# EAGLE design BluePillF4 (EAGLE 7.7.0)
AUTHOR: www.stm32duino.com; REV: A

## Sheet 1 of 2
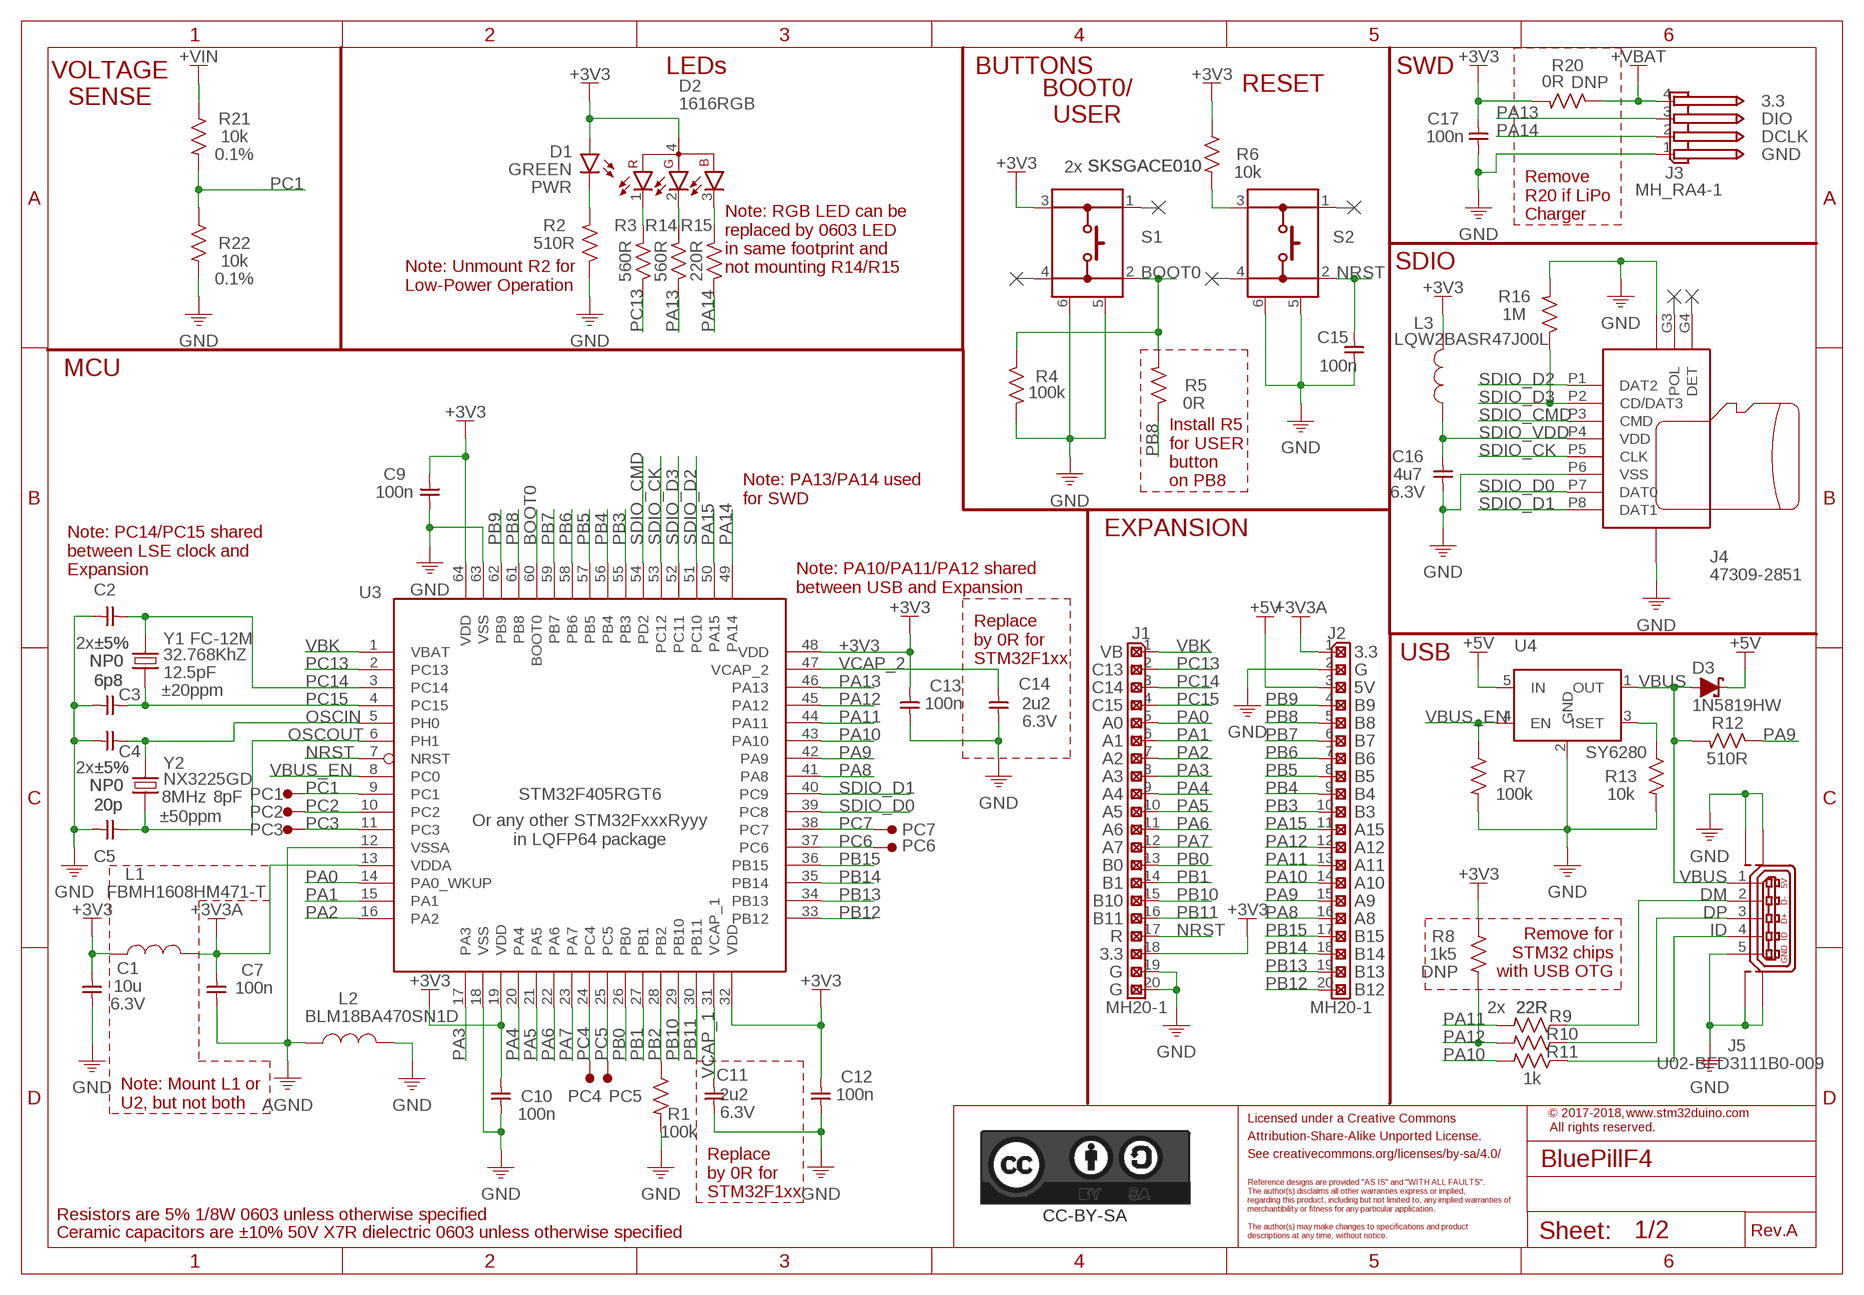
[diagram p0: schematic, sheet 1]
PORT1 (NC): BOM: EXCLUDE
PORT2 (NC): BOM: EXCLUDE
PORT3 (NC): BOM: EXCLUDE
PORT4 (NC): BOM: EXCLUDE
PORT5 (NC): BOM: EXCLUDE
PORT6 (NC): BOM: EXCLUDE

### Parts
C1  10u  CAP_0603  [C0603]
C2  6p8  CAP_0603  [C0603]
C3  6p8  CAP_0603  [C0603]
C4  20p  CAP_0603  [C0603]
C5  20p  CAP_0603  [C0603]
C7  100n  CAP_0603  [C0603]
C9  100n  CAP_0603  [C0603]
C10  100n  CAP_0603  [C0603]
C11  2u2  CAP_0603  [C0603]
C12  100n  CAP_0603  [C0603]
C13  100n  CAP_0603  [C0603]
C14  2u2  CAP_0603  [C0603]
C15  100n  CAP_0603  [C0603]
C16  4u7  CAP_0603  [C0603]
C17  100n  CAP_0603  [C0603]
D1  GREEN  LED_0603  [LED0603]
D2  1616RGB  [1616RGB]
D3  1N5819HW  [SOD-123]
J1  MH20-1  [MH20-1-0.1]
J2  MH20-1  [MH20-1-0.1]
J3  MH_RA4-1  [MH_RA4-1-0.1]
J4  47309-2851  [47309-2851]
J5  U02-BFD3111B0-009  [U02-BFD3111B0-009]
L1  FBMH1608HM471-T  FB_0603  [FB0603]
L2  BLM18BA470SN1D  FB_0603  [FB0603]
L3  LQW2BASR47J00L  FB_0805  [FB0805]
LOGO1  CC-BY-SA_LOGO  [CC-BY-SA_LOGO]
PC1  TEST_PAD  [TEST_PAD]
PC2  TEST_PAD  [TEST_PAD]
PC3  TEST_PAD  [TEST_PAD]
PC4  TEST_PAD  [TEST_PAD]
PC5  TEST_PAD  [TEST_PAD]
PC6  TEST_PAD  [TEST_PAD]
PC7  TEST_PAD  [TEST_PAD]
R1  100k  RES_0603  [R0603]
R2  510R  RES_0603  [R0603]
R3  560R  RES_0603  [R0603]
R4  100k  RES_0603  [R0603]
R5  0R  RES_0603  [R0603]
R6  10k  RES_0603  [R0603]
R7  100k  RES_0603  [R0603]
R8  1k5  RES_0603  [R0603]
R9  22R  RES_0603  [R0603]
R10  22R  RES_0603  [R0603]
R11  1k  RES_0603  [R0603]
R12  510R  RES_0603  [R0603]
R13  10k  RES_0603  [R0603]
R14  560R  RES_0603  [R0603]
R15  220R  RES_0603  [R0603]
R16  1M  RES_0603  [R0603]
R20  0R  RES_0603  [R0603]
R21  10k  RES_0603  [R0603]
R22  10k  RES_0603  [R0603]
S1  SKSGACE010  [SKSGACE010]
S2  SKSGACE010  [SKSGACE010]
U3  STM32F405RGT6  [LQFP64]
U4  SY6280  [SOT23-5]
Y1  FC-12M  [FC-12M]
Y2  NX3225GD  [CRYSTAL_32X25_2P]

### Nets
+3V3: C1.1 C9.2 C10.2 C12.1 C13.1 C17.2 D1.2(A) D2.4(A) J1.18 L1.1 L3.2 R6.1 R8.1 R20.2 S1.3(A) U3.19(VDD) U3.32(VDD) U3.48(VDD) U3.64(VDD) ; also sheet 2
+3V3A: C7.2 J2.1 L1.2 U3.13(VDDA) ; also sheet 2
+5V: D3.C J2.3 U4.5(IN) ; also sheet 2
+VBAT: J3.4 R20.1 ; also sheet 2
+VIN: R21.1 ; also sheet 2
AGND: C7.1 L2.1 U3.12(VSSA) ; also sheet 2
BOOT0: R4.1 R5.2 S1.2(B) U3.60(BOOT0)
D1: D1.1(C) R2.2
D2_B: D2.3(CB) R15.2
D2_G: D2.2(CG) R14.2
D2_R: D2.1(CR) R3.2
DM: J5.2 R9.1
DP: J5.3 R10.1
GND: C1.2 C2.2 C3.2 C4.2 C5.2 C9.1 C10.1 C11.1 C12.2 C13.2 C14.1 C15.1 C16.1 C17.1 J1.19 J1.20 J2.2 J3.1 J4.G1(GND) J4.G2(GND) J4.P6(VSS) J5.5 J5.S$1(M0) J5.S$2(M1) J5.S$3(M2) J5.S$4(M3) L2.2 R1.2 R2.1 R4.2 R7.2 R13.2 R16.2 R22.2 S1.5 S1.6 S2.5 S2.6 U3.18(VSS) U3.63(VSS) U4.2(GND) ; also sheet 2
ID: J5.4 R11.1
ISET: R13.1 U4.3(ISET)
NRST: C15.2 J1.17 S2.2(B) U3.7(NRST)
OSCIN: C4.1 U3.5(PH0) Y2.2
OSCOUT: C5.1 U3.6(PH1) Y2.1
PA0: J1.5 U3.14(PA0_WKUP)
PA1: J1.6 U3.15(PA1)
PA2: J1.7 U3.16(PA2)
PA3: J1.8 U3.17(PA3)
PA4: J1.9 U3.20(PA4)
PA5: J1.10 U3.21(PA5)
PA6: J1.11 U3.22(PA6)
PA7: J1.12 U3.23(PA7)
PA8: J2.16 U3.41(PA8)
PA9: J2.15 R12.1 U3.42(PA9)
PA10: J2.14 R11.2 U3.43(PA10)
PA11: J2.13 R9.2 U3.44(PA11)
PA12: J2.12 R8.2 R10.2 U3.45(PA12)
PA13: J3.3 R14.1 U3.46(PA13)
PA14: J3.2 R15.1 U3.49(PA14)
PA15: J2.11 U3.50(PA15)
PB0: J1.13 U3.26(PB0)
PB1: J1.14 U3.27(PB1)
PB2: R1.1 U3.28(PB2)
PB3: J2.10 U3.55(PB3)
PB4: J2.9 U3.56(PB4)
PB5: J2.8 U3.57(PB5)
PB6: J2.7 U3.58(PB6)
PB7: J2.6 U3.59(PB7)
PB8: J2.5 R5.1 U3.61(PB8)
PB9: J2.4 U3.62(PB9)
PB10: J1.15 U3.29(PB10)
PB11: J1.16 U3.30(PB11)
PB12: J2.20 U3.33(PB12)
PB13: J2.19 U3.34(PB13)
PB14: J2.18 U3.35(PB14)
PB15: J2.17 U3.36(PB15)
PC1: PC1.1(PP) R21.2 R22.1 U3.9(PC1)
PC2: PC2.1(PP) U3.10(PC2)
PC3: PC3.1(PP) U3.11(PC3)
PC4: PC4.1(PP) U3.24(PC4)
PC5: PC5.1(PP) U3.25(PC5)
PC6: PC6.1(PP) U3.37(PC6)
PC7: PC7.1(PP) U3.38(PC7)
PC13: J1.2 R3.1 U3.2(PC13)
PC14: C2.1 J1.3 U3.3(PC14) Y1.2
PC15: C3.1 J1.4 U3.4(PC15) Y1.1
R6: R6.2 S2.3(A)
SDIO_CK: J4.P5(CLK) U3.53(PC12)
SDIO_CMD: J4.P3(CMD) U3.54(PD2)
SDIO_D0: J4.P7(DAT0) U3.39(PC8)
SDIO_D1: J4.P8(DAT1) U3.40(PC9)
SDIO_D2: J4.P1(DAT2) U3.51(PC10)
SDIO_D3: J4.P2(CD/DAT3) R16.1 U3.52(PC11)
SDIO_VDD: C16.2 J4.P4(VDD) L3.1
VBK: J1.1 U3.1(VBAT)
VBUS: D3.A J5.1 R12.2 U4.1(OUT)
VBUS_EN: R7.1 U3.8(PC0) U4.4(EN)
VCAP_1: C11.2 U3.31(VCAP_1)
VCAP_2: C14.2 U3.47(VCAP_2)
Unconnected: J4.G3(POL) J4.G4(DET) S1.1(A) S1.4(B) S2.1(A) S2.4(B)

### Notes on the sheet
- LEDs | BUTTONS | SWD
- VOLTAGE
  SENSE
- RESET
- BOOT0/
  USER
- 3.3
- DIO
- DCLK
- GND
- 2x
- PWR
- Remove
  R20 if LiPo
  Charger
- SDIO
- Note: RGB LED can be
  replaced by 0603 LED
  in same footprint and
  not mounting R14/R15
- Note: Unmount R2 for
  Low-Power Operation
- MCU
- Install R5
  for USER
  button
  on PB8
- Note: PA13/PA14 used
  for SWD
- EXPANSION
- Note: PC14/PC15 shared
  between LSE clock and
  Expansion
- Note: PA10/PA11/PA12 shared
  between USB and Expansion
- 2x
- VB | 3.3 | USB
- Replace
  by 0R for
  STM32F1xx
- C13 | G
- C14 | 5V
- C15 | B9
- A0 | B8
- A1 | B7
- A2 | B6
- 2x
- A3 | B5
- A4 | B4
- A5 | B3
- Or any other STM32FxxxRyyy
  in LQFP64 package
- A6 | A15
- A7 | A12
- B0 | A11
- B1 | A10
- B10 | A9
- B11 | A8
- R | B15
- 3.3 | B14
- G | B13
- Remove for
  STM32 chips
  with USB OTG
- G | B12
- 2x
- Note: Mount L1 or
  U2, but not both
- © 2017-2018,
- Licensed under a Creative Commons
- All rights reserved.
- Attribution-Share-Alike Unported License.
- See creativecommons.org/licenses/by-sa/4.0/
- Reference designs are provided "AS IS" and "WITH ALL FAULTS".
- The author(s) disclaims all other warranties express or implied,
- Replace
  by 0R for
  STM32F1xx
- regarding this product, including but not limited to, any implied warranties of
- merchantibility or fitness for any particular application.
- Resistors are 5% 1/8W 0603 unless otherwise specified
- The author(s) may make changes to specifications and product
- Ceramic capacitors are ±10% 50V X7R dielectric 0603 unless otherwise specified | descriptions at any time, without notice. | Rev.

## Sheet 2 of 2
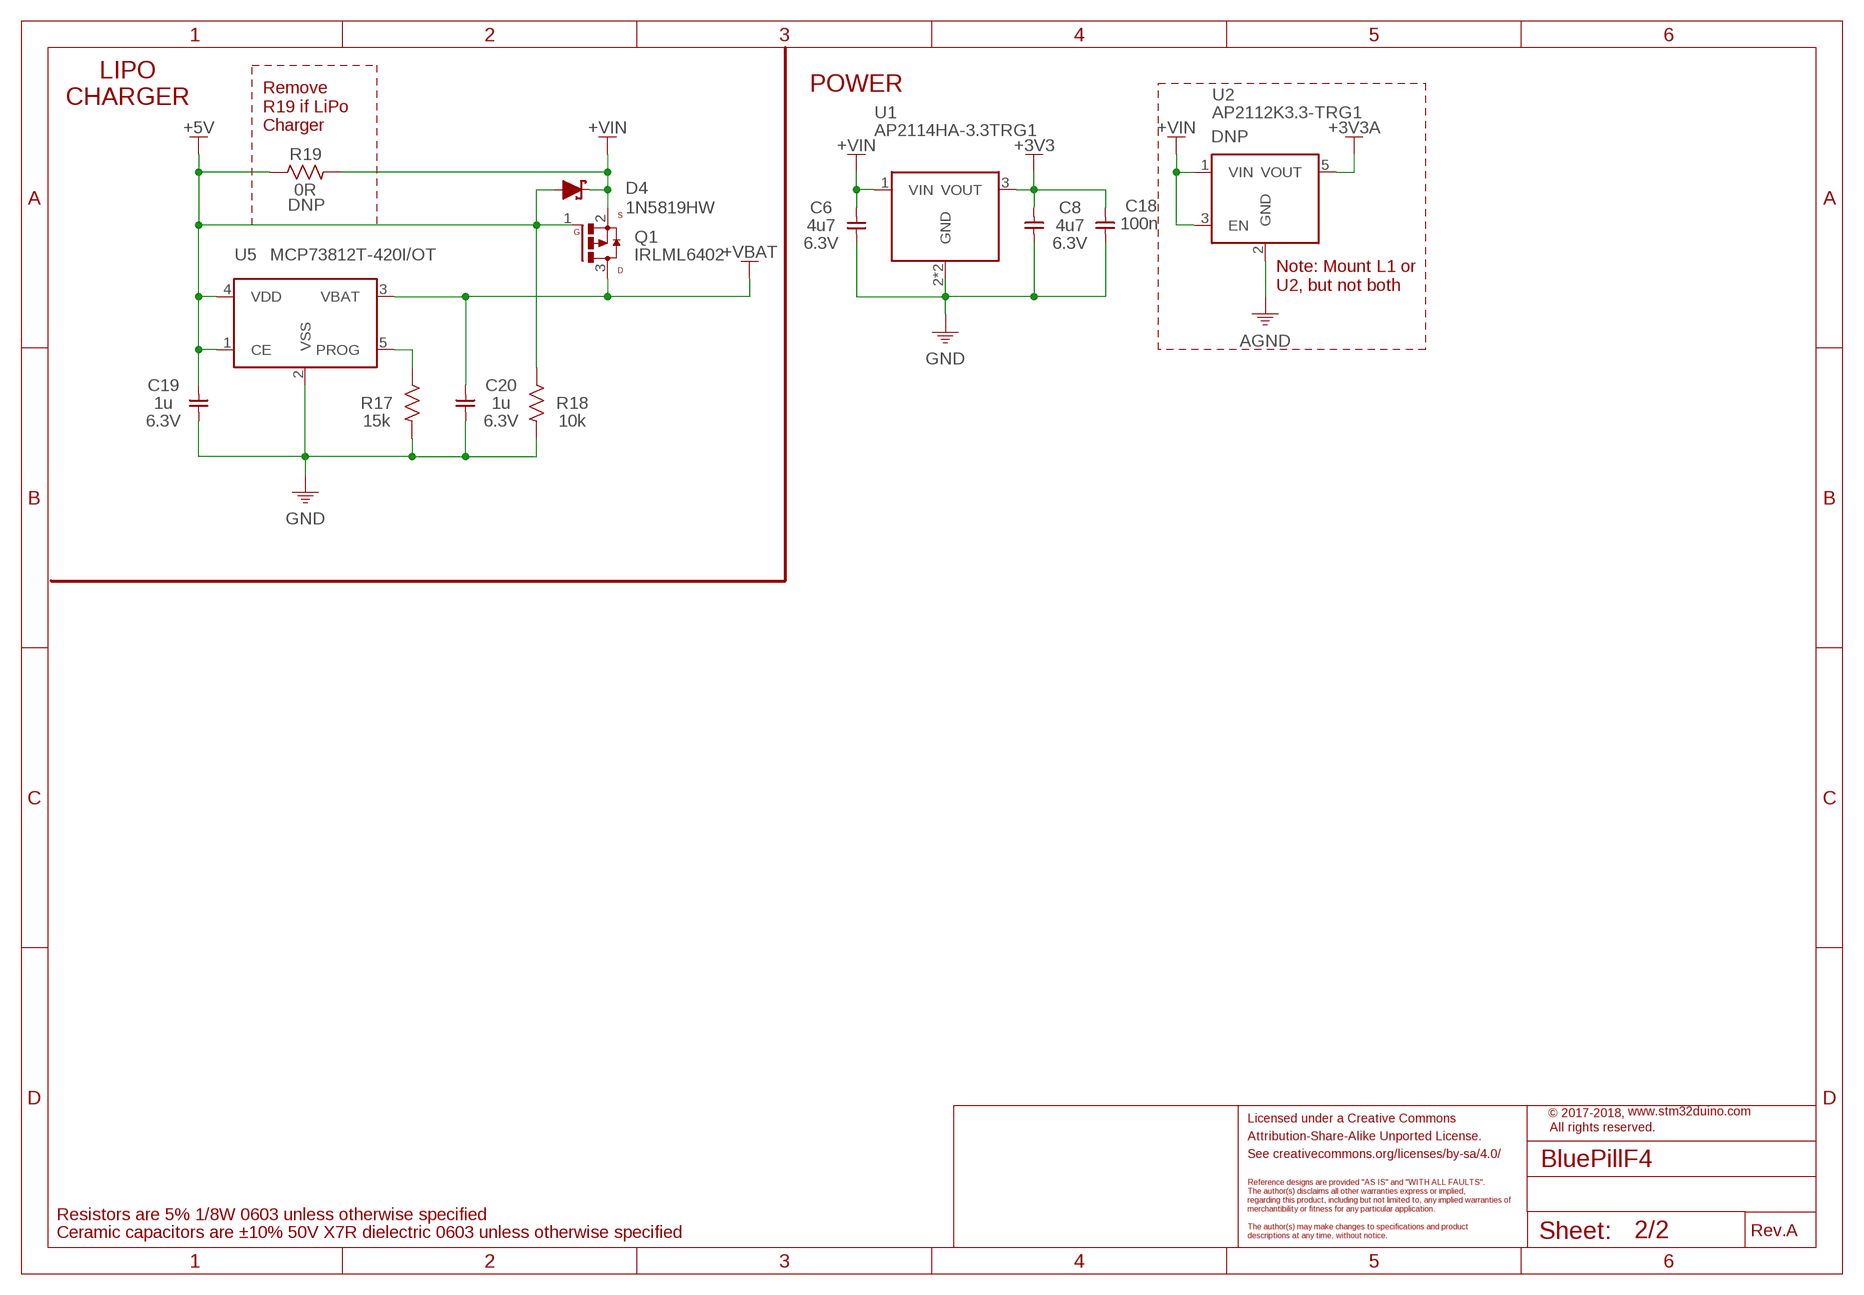
[diagram p1: schematic, sheet 2]

### Parts
C6  4u7  CAP_0603  [C0603]
C8  4u7  CAP_0603  [C0603]
C18  100n  CAP_0603  [C0603]
C19  1u  CAP_0603  [C0603]
C20  1u  CAP_0603  [C0603]
D4  1N5819HW  [SOD-123]
Q1  IRLML6402  [SOT323]
R17  15k  RES_0603  [R0603]
R18  10k  RES_0603  [R0603]
R19  0R  RES_0603  [R0603]
U1  AP2114HA-3.3TRG1  [SOT223]
U2  AP2112K3.3-TRG1  [SOT23-5]
U5  MCP73812T-420I/OT  [SOT23-5]

### Nets
+3V3: C8.1 C18.1 U1.3(VOUT) ; also sheet 1
+3V3A: U2.5(VOUT) ; also sheet 1
+5V: C19.1 D4.A Q1.1(G) R18.1 R19.1 U5.1(CE) U5.4(VDD) ; also sheet 1
+VBAT: C20.1 Q1.3(D) U5.3(VBAT) ; also sheet 1
+VIN: C6.1 D4.C Q1.2(S) R19.2 U1.1(VIN) U2.1(VIN) U2.3(EN) ; also sheet 1
AGND: U2.2(GND) ; also sheet 1
GND: C6.2 C8.2 C18.2 C19.2 C20.2 R17.2 R18.2 U1.2(GND) U1.PAD(GND) U5.2(VSS) ; also sheet 1
PROG: R17.1 U5.5(PROG)

### Notes on the sheet
- LIPO
  CHARGER
- POWER
- Remove
  R19 if LiPo
  Charger
- Note: Mount L1 or
  U2, but not both
- © 2017-2018,
- Licensed under a Creative Commons
- All rights reserved.
- Attribution-Share-Alike Unported License.
- See creativecommons.org/licenses/by-sa/4.0/
- Reference designs are provided "AS IS" and "WITH ALL FAULTS".
- The author(s) disclaims all other warranties express or implied,
- regarding this product, including but not limited to, any implied warranties of
- merchantibility or fitness for any particular application.
- Resistors are 5% 1/8W 0603 unless otherwise specified
- The author(s) may make changes to specifications and product
- Ceramic capacitors are ±10% 50V X7R dielectric 0603 unless otherwise specified | descriptions at any time, without notice. | Rev.

## Library data of the parts
C1 = BluePillF4:CAP_: Capacitor; PARTNO: C0603_10u_X7R_10%_CER_6V3; SIZE: 0603; TC: X7R; TOL: ±10%; TYPE: CER; VOLT: 6.3V
C2 C3 = BluePillF4:CAP_: Capacitor; PARTNO: C0603_6p8_NP0_5%_CER_50V; SIZE: 0603; TC: NP0; TOL: ±5%; TYPE: CER; VOLT: 50V
C4 C5 = BluePillF4:CAP_: Capacitor; PARTNO: C0603_20p_NP0_5%_CER_50V; SIZE: 0603; TC: NP0; TOL: ±5%; TYPE: CER; VOLT: 50V
C6 C8 C16 = BluePillF4:CAP_: Capacitor; PARTNO: C0603_4u7_X7R_10%_CER_6V3; SIZE: 0603; TC: X7R; TOL: ±10%; TYPE: CER; VOLT: 6.3V
C7 C9 C10 C12 C13 C15 C17 C18 = BluePillF4:CAP_: Capacitor; PARTNO: C0603_100n_X7R_10%_CER_50V; SIZE: 0603; TC: X7R; TOL: ±10%; TYPE: CER; VOLT: 50V
C11 C14 = BluePillF4:CAP_: Capacitor; PARTNO: C0603_2u2_X7R_10%_CER_6V3; SIZE: 0603; TC: X7R; TOL: ±10%; TYPE: CER; VOLT: 6.3V
C19 C20 = BluePillF4:CAP_: Capacitor; PARTNO: C0603_1u_X7R_10%_CER_6V3; SIZE: 0603; TC: X7R; TOL: ±10%; TYPE: CER; VOLT: 6.3V
D1 = BluePillF4:LED_: LED; PARTNO: LED0603-GREEN
D2 = BluePillF4:1616RGB: 16 mm x 16 mm RGB LED with Common Anode; PARTNO: LED1616-RGB
D3 D4 = BluePillF4:1N5819HW: 1.0A Surface Mount Schottky Barrier Rectifier; PARTNO: 1N5819HW; RATE: 1A; VOLT: 40V
J1 J2 = BluePillF4:MH20-1: 20x1 Pin Male Header; PARTNO: MH20-1-0.1
J3 = BluePillF4:MH_RA4-1: 4x1 Pin Male Header; PARTNO: MH_RA4-1-0.1
J4 = BluePillF4:47309-*: TFR Header with Detect Pin; HEIGHT: 2.85mm; PARTNO: 47309-2851
J5 = BluePillF4:U02-BFD3111B0-009: Mid mount PCB SMT Micro USB Type B Female Socket Solder Jack 5 Pin 4 legs; PARTNO: U02-BFD3111B0-009
L1 = BluePillF4:FB_: Ferrite Bead; PARTNO: FBMH1608HM471-T; RATE: 1A; SIZE: 0603
L2 = BluePillF4:FB_: Ferrite Bead; PARTNO: BLM18BA470SN1D; RATE: 300mA; SIZE: 0603
L3 = BluePillF4:FB_: Ferrite Bead; PARTNO: LQW2BASR47J00L; RATE: 250mA; SIZE: 0805
LOGO1 = BluePillF4:CC-BY-SA_LOGO: Attribution-Share-Alike Unported License See creativecommons.org/licenses/by-sa/3.0/ for details.; BOM: EXCLUDE
PC1-PC7 = BluePillF4:TEST_PAD: Test Pad; BOM: EXCLUDE
Q1 = BluePillF4:IRLML6402: HEXFET Power MOSFET; PARTNO: IRLM6402; RATE: 1.3A; VOLT: 20V
R1 R4 R7 = BluePillF4:RES_: Resistor; PARTNO: R0603_100k_5%_125mW; RATE: 125mW; SIZE: 0603; TOL: 5%
R2 R3 R5 R12 R14 R15 = BluePillF4:RES_: Resistor; PARTNO: R0603_510R_5%_125mW; RATE: 125mW; SIZE: 0603; TOL: 5%
R6 R13 = BluePillF4:RES_: Resistor; PARTNO: R0603_10k_5%_125mW; RATE: 125mW; SIZE: 0603; TOL: 5%
R8 = BluePillF4:RES_: Resistor; DNP: T; PARTNO: R0603_1k5_5%_125mW; RATE: 125mW; SIZE: 0603; TOL: 5%
R9 R10 = BluePillF4:RES_: Resistor; PARTNO: R0603_22R_5%_125mW; RATE: 125mW; SIZE: 0603; TOL: 5%
R11 = BluePillF4:RES_: Resistor; PARTNO: R0603_1k_5%_125mW; RATE: 125mW; SIZE: 0603; TOL: 5%
R16 = BluePillF4:RES_: Resistor; PARTNO: R0603_1M_5%_125mW; RATE: 125mW; SIZE: 0603; TOL: 5%
R17 R18 = BluePillF4:RES_: Resistor; PARTNO: R0603_15k_5%_125mW; RATE: 125mW; SIZE: 0603; TOL: 5%
R19 = BluePillF4:RES_: Resistor; DNP: T; PARTNO: R06030R_5%_125mW; RATE: 125mW; SIZE: 0603; TOL: 5%
R20 = BluePillF4:RES_: Resistor; DNP: T; PARTNO: R0603_510R_5%_125mW; RATE: 125mW; SIZE: 0603; TOL: 5%
R21 R22 = BluePillF4:RES_: Resistor; DNP: F; PARTNO: R0603_10k_0.1%_125mW; RATE: 125mW; SIZE: 0603; TOL: 0.1%
S1 S2 = BluePillF4:SKSGACE010: Surface Mount Type TACT Switch; HEIGHT: 1.4mm; PARTNO: SKSGACE010
U1 = BluePillF4:AP2114?-*TRG1: 1A Low-Noise CMOS LDO Regulator; HEIGHT: 1.7mm; PARTNO: AP2114HA3.3-TRG1; RATE: 1A; VOLT: 3.3V
U2 = BluePillF4:AP2112?*-TRG1: 600mA CMOS LDO Regulator with Enable; DNP: T; HEIGHT: 1.3mm; PARTNO: AP2112K3.3-TRG1; RATE: 1A; VOLT: 3.3V
U3 = BluePillF4:STM32F405?: ARM Cortex-M4 32b MCU+FPU, 210DMIPS, up to 1MB Flash/192+4KB RAM, USB OTG HS/FS, Ethernet, 17 TIMs, 3 ADCs, 15 comm. interfaces & camera; HEIGHT: 1.6mm; PARTNO: STM32F405RGT6
U4 = BluePillF4:SY6280: Low-Loss Power Distribution Switch; HEIGHT: 1.3mm; PARTNO: SY6280AAC
U5 = BluePillF4:MCP7381*T-420I/OT: Simple, Miniature Single-Cell, Fully Integrated Li-Ion / Li-Polymer Charge Management Controllers; PARTNO: MCP73812T-420I/OT
Y1 = BluePillF4:FC-12M: Seiko Epson kHz Range 2 pin Crystal; CAP: 12.5pF; FREQ: 32.768KhZ; PARTNO: FC-12M 32.7680KA-A3; TOL: ±20ppm
Y2 = BluePillF4:NX3225GD: 3.2 mm x 2.5 mm Crystal, 2 Pads; CAP: 8pF; FREQ: 8MHz; PARTNO: NX3225GD-8MHZ-STD-CRA-3; TOL: ±50ppm

## Board
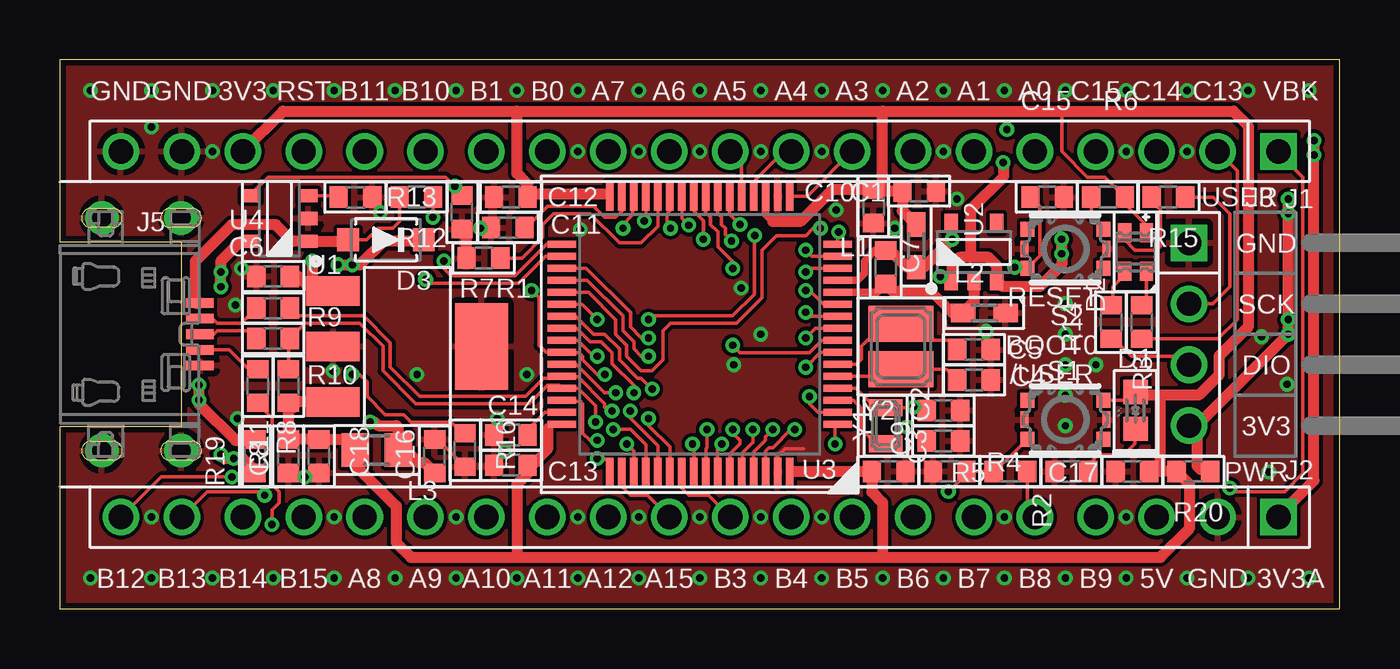
[diagram p2: board, top side]
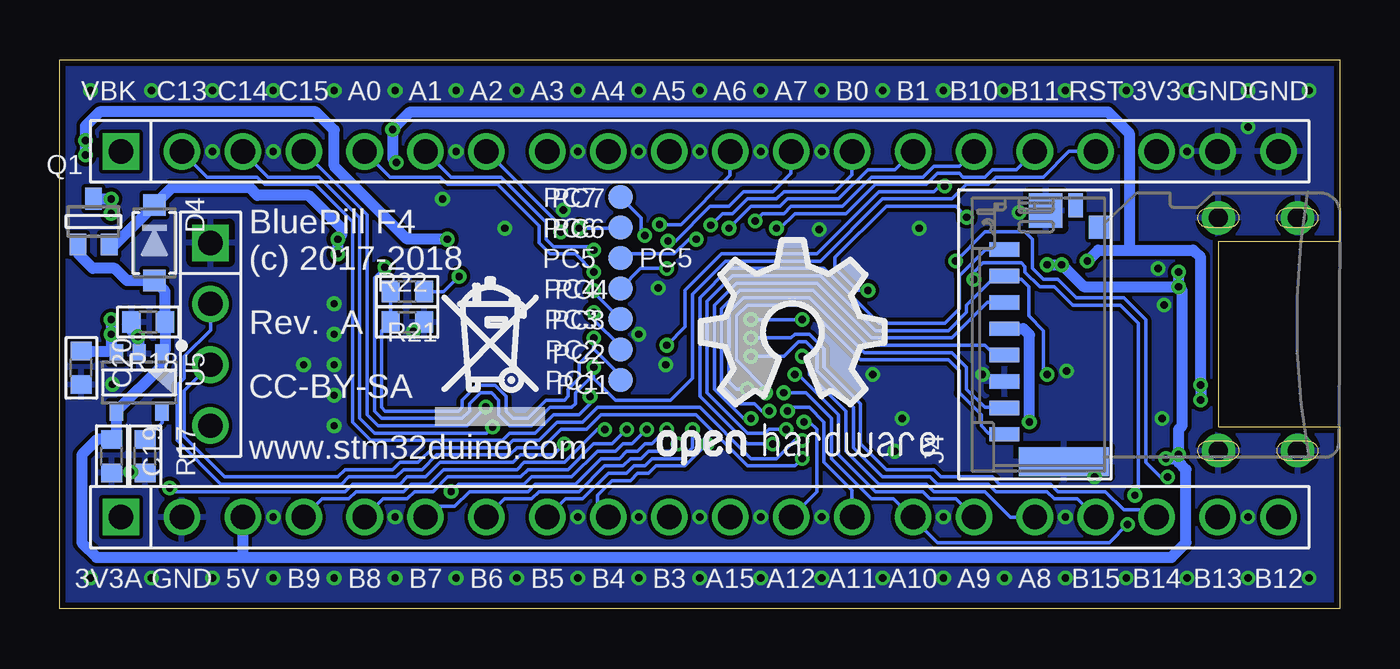
[diagram p3: board, bottom side, seen from below]

Size 53.34 x 22.86 mm. Coordinates in mm from the lower left corner, seen from the top.
Outline: 0,0 53.34,0 53.34,22.86 0,22.86 0,15.28 5.05,15.28 5.05,7.58 0,7.58 0,0
Copper layers (1*16): Top 0.035mm / dielectric 1.5mm / Bottom 0.035mm
Design rules "SeeedStudio_2layer_DRU_no_angle_20140221 *": minimum track width 6mil, minimum drill 12mil, track to track 6mil, track to pad 6mil, pad to pad 6mil, via to via 6mil, smd to smd 0mil, copper to edge 10mil, drill to drill 10mil, minimum pad ring 10mil, minimum via ring 6mil, stop-mask expansion 2mil, vias tented up to drill 100mil, thermal gap 10mil

### Footprints (pad centres in the part's own frame; a part is rotated, then mirrored left to right if it is on the bottom)
C0603 = smd 0.762 x 0.889: 1 -0.699,0; 2 0.699,0
LED0603 = smd 1.016 x 1.016: 1 -0.762,0; 2 0.762,0
1616RGB = smd 0.8 x 0.55: 1 -0.8,-0.45; 2 -0.8,0.45; 3 0.8,0.45; 4 0.8,-0.45
SOD-123 = smd 0.9 x 0.95: A 1.575,0; C -1.575,0
MH20-1-0.1 = drill 1.016 square: 1 0,0 | drill 1.016: 2 2.54,0; 3 5.08,0; 4 7.62,0; 5 10.16,0; 6 12.7,0; 7 15.24,0; 8 17.78,0; 9 20.32,0; 10 22.86,0; 11 25.4,0; 12 27.94,0; 13 30.48,0; 14 33.02,0; 15 35.56,0; 16 38.1,0; 17 40.64,0; 18 43.18,0; 19 45.72,0; 20 48.26,0
MH_RA4-1-0.1 = drill 1.016 square: 1 -3.81,-3.81 | drill 1.016: 2 -1.27,-3.81; 3 1.27,-3.81; 4 3.81,-3.81
47309-2851 = smd 1.2 x 3.75: G1 -5,-2.48 | smd 1.45 x 1.4: G2 5.475,-1.725 | smd 1 x 0.6: G3 5.7,-2.975 | smd 0.95 x 0.85: G4 4.775,-3.95 | smd 0.6 x 1.25: P1 3.85,0; P2 2.75,0; P3 1.65,0; P4 0.55,0; P5 -0.55,0; P6 -1.65,0; P7 -2.75,0; P8 -3.85,0
U02-BFD3111B0-009 = smd 0.4 x 1.15: 1 -1.3,3.93; 2 -0.65,3.93; 3 0,3.93; 4 0.65,3.93; 5 1.3,3.93 | drill 0.8 pad 1.4: S$1 -4.85,-0.155; S$2 4.85,-0.155; S$3 -4.85,3.145; S$4 4.85,3.145
FB0603 = smd 1.016 x 0.762: 1 -0.889,0; 2 0.889,0
FB0805 = smd 1.15 x 1.4: 1 -0.9,0; 2 0.9,0
TEST_PAD = smd 1 x 1: 1 0,0
SOT323 = smd 0.7 x 0.9: 1 -0.65,-0.95; 2 0.65,-0.95; 3 0,0.95
R0603 = smd 0.762 x 0.889: 1 -0.699,0; 2 0.699,0
SKSGACE010 = smd 0.575 x 0.625: 1 -1.587,0.812; 2 -1.587,-0.812; 3 1.587,0.812; 4 1.587,-0.812 | smd 0.325 x 0.699: 5 -1.712,0; 6 1.712,0
SOT223 = smd 1.219 x 2.235: 1 -2.311,-3.099; 2 0,-3.099; 3 2.311,-3.099 | smd 3.6 x 2.2: PAD 0,3.099
SOT23-5 = smd 0.55 x 0.8: 1 -0.95,-1.2; 2 0,-1.2; 3 0.95,-1.2; 4 0.95,1.2; 5 -0.95,1.2
LQFP64 = smd 1.2 x 0.3: 1 -5.75,3.75; 2 -5.75,3.25; 3 -5.75,2.75; 4 -5.75,2.25; 5 -5.75,1.75; 6 -5.75,1.25; 7 -5.75,0.75; 8 -5.75,0.25; 9 -5.75,-0.25; 10 -5.75,-0.75; 11 -5.75,-1.25; 12 -5.75,-1.75; 13 -5.75,-2.25; 14 -5.75,-2.75; 15 -5.75,-3.25; 16 -5.75,-3.75; 33 5.75,-3.75; 34 5.75,-3.25; 35 5.75,-2.75; 36 5.75,-2.25; 37 5.75,-1.75; 38 5.75,-1.25; 39 5.75,-0.75; 40 5.75,-0.25; 41 5.75,0.25; 42 5.75,0.75; 43 5.75,1.25; 44 5.75,1.75; 45 5.75,2.25; 46 5.75,2.75; 47 5.75,3.25; 48 5.75,3.75 | smd 0.3 x 1.2: 17 -3.75,-5.75; 18 -3.25,-5.75; 19 -2.75,-5.75; 20 -2.25,-5.75; 21 -1.75,-5.75; 22 -1.25,-5.75; 23 -0.75,-5.75; 24 -0.25,-5.75; 25 0.25,-5.75; 26 0.75,-5.75; 27 1.25,-5.75; 28 1.75,-5.75; 29 2.25,-5.75; 30 2.75,-5.75; 31 3.25,-5.75; 32 3.75,-5.75; 49 3.75,5.75; 50 3.25,5.75; 51 2.75,5.75; 52 2.25,5.75; 53 1.75,5.75; 54 1.25,5.75; 55 0.75,5.75; 56 0.25,5.75; 57 -0.25,5.75; 58 -0.75,5.75; 59 -1.25,5.75; 60 -1.75,5.75; 61 -2.25,5.75; 62 -2.75,5.75; 63 -3.25,5.75; 64 -3.75,5.75
FC-12M = smd 0.7 x 1.4: 1 -0.75,0; 2 0.75,0
CRYSTAL_32X25_2P = smd 1.5 x 2.7: 1 -0.95,0; 2 0.95,0

### Placement (x,y rotation side)
C1  35.81,17.4 0 top
C2  36.83,6.99 0 top
C3  36.83,8.26 0 top
C4  38.1,9.53 0 top
C5  38.1,10.79 0 top
C6  8.89,13.84 180 top
C7  34.42,14.22 90 top
C8  9.53,6.35 270 top
C9  34.54,5.71 180 top
C10  33.91,16.76 90 top
C11  18.67,15.88 0 top
C12  18.8,17.14 180 top
C13  18.8,5.97 180 top
C14  18.8,7.24 0 top
C15  41.15,17.14 180 top
C16  15.62,6.35 270 top
C17  44.7,5.71 0 top
C18  10.79,6.35 270 top
C19  51.18,6.35 270 bottom
C20  52.45,10.03 270 bottom
D1  44.83,8.26 90 top
D2  44.83,14.86 90 top
D3  13.59,15.37 180 top
D4  49.4,15.24 270 bottom
DRILEGEND  [DRILEGEND]  91.69,25.65 0 top  (outside the outline)
J1  50.8,19.05 180 top
J2  50.8,3.81 180 top
J3  50.88,11.43 270 top
J4  13.97,11.11 90 bottom
J5  1.91,11.43 270 top
L1  35.69,15.11 270 top
L2  38.53,12.32 0 top
L3  13.21,6.6 180 top
LOGO1  5.08,-53.34 0 top  (outside the outline)
PC1  29.97,9.53 180 bottom
PC2  29.97,10.79 180 bottom
PC3  29.97,12.06 180 bottom
PC4  29.97,13.34 180 bottom
PC5  29.97,14.61 0 bottom
PC6  29.97,15.88 0 bottom
PC7  29.97,17.14 0 bottom
Q1  51.94,16.13 0 bottom
R1  17.65,14.61 180 top
R2  42.16,5.71 0 top
R3  45.09,11.94 90 top
R4  37.08,5.71 180 top
R5  39.62,5.71 180 top
R6  43.69,17.14 180 top
R7  16.76,16.51 270 top
R8  9.53,9.27 90 top
R9  8.89,12.52 0 top
R10  8.89,11.25 0 top
R11  8.26,9.27 270 top
R12  14.86,17.14 180 top
R13  12.32,17.14 0 top
R14  43.81,11.94 90 top
R15  46.2,17.14 180 top
R16  16.89,6.6 270 top
R17  49.78,6.35 270 bottom
R18  49.66,11.94 180 bottom
R19  8.13,6.35 90 top
R20  47.24,5.71 180 top
R21  38.86,13.21 180 bottom
R22  38.86,11.94 0 bottom
S1  41.91,7.87 0 top
S2  41.91,14.99 0 top
U1  14.48,10.92 270 top
U2  38.1,14.86 0 top
U3  26.67,11.43 180 top
U4  9.14,16.26 90 top
U5  50.04,9.42 180 bottom
U$2  [A5L-LOC]  -45.72,-63.5 0 top  (outside the outline)
U$4  [OPEN_HARDWARE_LOGO]  22.81,11.43 0 bottom
U$6  [RECYCLE_BIN_LOGO]  37.69,7.62 0 bottom
Y1  34.42,7.62 270 top
Y2  35.05,10.92 270 top

### Tracks (layer width: path | path; a pad name or v marks a point on that pad's centre or on a via)
+3V3
  Top 0.152: S1.3 44.5,8.69 D1.2 | 41.76,20.73 41.76,19.05 42.82,17.98 43.55,17.98 R6.1 44.39,16.88 45.28,15.98 D2.4
  Top 0.305: 20.34,7.52 20.51,7.68 U3.48 | U3.19 29.42,16.43 29.72,16.13 | U3.32 22.86,17.18 22.77,17.27 | 30.63,5.71 30.42,5.71 U3.64
  Top 0.406: 20.34,7.52 20.34,6.63 19.81,6.1
  Top 0.457: 19.05,2.13 19.05,5.18 19.49,5.63 C13.1 19.68,5.97 19.81,6.1 | 19.05,2.13 34.29,2.13 | 34.29,2.13 45.87,2.13 47.09,3.35 47.09,5.17 R20.2 45.85,5.71 | J1.18 9.3,20.73 19.05,20.73 | 19.05,20.73 34.29,20.73 | 34.29,20.73 41.76,20.73 48.92,20.73 49.53,20.12 49.53,11.73 48.31,10.52 48.31,9.73 47.47,8.89 45.85,8.89 | 19.05,20.73 19.05,18.14 19.49,17.69 C12.1 19.62,17.27 22.77,17.27 | 34.29,2.13 34.29,4.42 33.85,4.86 C9.2 30.63,5.71 | 29.72,16.13 30.86,16.13 32.19,17.46 C10.2 | 11.38,8.59 U1.3 9.83,8.61 9.75,8.53 | 19.05,2.13 14.63,2.13 14.02,2.74 14.02,4.27 12.31,5.98 L3.2 11.86,7.05 C18.1 C8.1 R8.1 9.72,8.57 9.75,8.53 | 9.75,8.61 9.75,8.53 | 9.75,8.53 9.75,8.38 | 34.29,17.4 34.29,20.73 | 45.85,5.71 C17.2 | 45.85,8.89 45.85,5.71 | 45.85,8.89 44.96,8.89 D1.2 | 34.29,17.4 C1.1 35.12,16.57 L1.1 | C10.2 33.97,17.4 34.29,17.4 | 33.83,17.48 33.83,17.39 | 33.83,17.37 33.83,17.39 | 33.83,17.39 C10.2
+3V3A  (via drill 0.3 pad 0.61)
  Top 0.305: U3.13 33.24,13.68 33.53,13.97 33.53,14.48 33.97,14.92 C7.2
  Top 0.457: U2.5 37.19,16.02 v37.19,15.39 36.02,14.22 L1.2 35.31,14.22 34.61,14.92 C7.2 | v52.27,19.51 v52.27,18.9 52.27,5.33 50.8,3.86 J2.1
  Bottom 0.457: v52.27,18.9 v52.27,19.51 52.27,20.12 51.69,20.7 42.67,20.7 41.91,19.94 41.91,18.44 38.86,15.39 v37.19,15.39
+5V  (via drill 0.3 pad 0.61)
  Top 0.457: D3.C 15.16,15.32 15.09,15.32 | R19.1 8.13,5.74 7.62,6.25 v7.24,6.25 6.86,6.25 6.71,6.4 | v6.71,13.41 v6.71,14.02 6.71,14.48 7.53,15.31 U4.5 | 15.01,15.32 15.01,15.24 | 15.01,15.24 15.01,15.16 | v11.58,14.33 v12.19,14.33 12.5,14.33 13.49,15.32 15.09,15.32 | 15.09,15.32 15.01,15.24
  Bottom 0.457: 45.72,2.13 7.01,2.13 6.4,2.74 6.4,5.79 6.71,6.1 | 6.71,6.1 v6.71,6.43 6.71,7.47 6.55,7.62 6.55,13.26 v6.71,13.41 | 45.72,2.13 51.82,2.13 52.43,2.74 52.43,6.4 51.78,7.05 C19.1 50.99,7.24 U5.4 49.09,10.12 U5.1 48.96,10.75 R18.1 48.96,13.22 D4.A 50.55,13.66 51.05,14.17 51.97,14.17 52.58,14.78 52.58,15.16 Q1.1 | J2.3 45.72,2.13 | v6.71,13.41 v6.71,14.02 | v7.24,6.25 6.86,6.25 6.71,6.1 | v12.19,14.33 v11.58,14.33 10.67,13.41 v6.71,13.41
+VBAT  (via drill 0.3 pad 0.61)
  Top 0.457: v51.21,17.07 v51.21,16.46 v51.21,12.04 v51.21,11.43 47.4,7.62 47.09,7.62 | J3.4 47.09,7.62 | 47.09,7.62 47.4,7.32 47.4,5.94 47.55,5.79 47.87,5.79 R20.1
  Bottom 0.457: v51.21,16.46 v51.21,17.07 v51.22,17.08 Q1.3 | v51.21,12.04 v51.21,11.43 51.21,10.84 | 51.21,10.84 U5.3 | C20.1 51.32,10.73 51.21,10.84
+VIN  (via drill 0.3 pad 0.61)
  Top 0.152: 37.09,13.72 U2.1 36.97,13.84 v36.7,13.84
  Top 0.457: C6.1 9.93,13.84 10.36,13.41 10.52,13.41 | 10.52,13.41 11.2,13.41 U1.1 | v5.79,9.32 v5.79,8.69 5.79,8.53 7.32,7.01 8.09,7.01 R19.2 | v41.76,15.39 v41.76,14.78 41.76,14.33 40.84,13.41 39.3,13.41 U2.3 39.05,14.29 38.71,14.63 37.95,14.63 | 37.95,14.63 37.49,14.63 37.19,14.33 37.19,13.7 U2.1 | v39.32,18.59 39.32,17.98 37.95,16.61 37.95,14.63 | v10.52,14.48 10.52,13.41
  Bottom 0.152: R21.1 37.34,13.21 v36.7,13.84
  Bottom 0.457: v5.79,8.69 v5.79,9.32 5.79,14.63 6.1,14.94 8.84,14.94 | 41.76,14.94 v41.76,15.39 41.6,15.54 41.6,15.85 42.98,17.22 45.11,17.22 45.41,17.53 48.69,17.53 D4.C 51.04,15.18 Q1.2 | v39.32,18.59 39.47,18.75 v39.47,19.96 38.73,20.7 9.65,20.7 8.76,19.81 8.76,15.01 8.84,14.94 | v10.52,14.48 10.06,14.94 8.84,14.94
AGND
  Top 0.305: U3.12 34.07,13.18 C7.1
  Top 0.406: 36.32,13.21 37.21,12.32
  Top 0.457: 37.62,12.34 L2.1 | U2.2 38.1,12.78 L2.1 | L2.1 37.21,12.32 | 36.32,13.21 34.73,13.21 C7.1
BOOT0  (via drill 0.3)
  Top 0.152: U3.60 28.45,5.71 28.45,6.5 28.88,6.93 v28.88,7.47 | v37.03,4.88 37.78,5.63 R4.1 R5.2 38.98,5.71 S1.2
  Bottom 0.152: v37.03,4.88 36.73,5.18 33.98,5.18 33.68,5.49 32,5.49 30.94,6.55 30.18,6.55 29.87,6.86 29.49,6.86 v28.88,7.47
D1
  Top 0.152: D1.1 44.81,7.47 44.81,6.86 44.35,6.4 43.28,6.4 42.86,5.98 R2.2
D2_B
  Top 0.152: D2.3 44.38,15.36 44.81,14.94 45.72,14.94 45.87,15.09 45.87,16.61 45.5,16.98 R15.2
D2_G
  Top 0.152: D2.2 44.38,13.9 43.89,13.41 43.89,12.71 R14.2
D2_R
  Top 0.152: D2.1 45.28,12.83 R3.2
DM
  Top 0.152: J5.2 6.36,12.08 6.55,11.89 7.56,11.89 R9.1
DP
  Top 0.152: J5.3 6.4,11.43 6.55,11.58 7.86,11.58 R10.1
GND  (via drill 0.3)
  Top 0.152: U3.63 29.92,6.35 30.23,6.66 30.99,6.66 | v18.54,6.55 18.54,6.41 C13.2 | C16.1 15.75,7.05 R16.2 | v10.21,5.49 10.63,5.49 C18.2
  Top 0.457: R1.2 16.95,15.62 R7.2
  Bottom 0.457: U5.2 50.04,11.33 v50.09,11.33 50.35,11.6 R18.2
  other vias: 43.18,10.16 41.91,11.43 1.27,1.27 3.81,1.27 6.35,1.27 8.89,1.27 11.43,1.27 13.97,1.27 16.51,1.27 19.05,1.27 21.59,1.27 24.13,1.27 26.67,1.27 29.21,1.27 31.75,1.27 34.29,1.27 36.83,1.27 39.37,1.27 41.91,1.27 44.45,1.27 46.99,1.27 52.07,21.59 49.53,21.59 46.99,21.59 44.45,21.59 41.91,21.59 39.37,21.59 36.83,21.59 34.29,21.59 31.75,21.59 29.21,21.59 26.67,21.59 24.13,21.59 21.59,21.59 19.05,21.59 16.51,21.59 13.97,21.59 11.43,21.59 8.89,21.59 6.35,21.59 3.81,21.59 1.27,21.59 28.09,10.16 41.91,12.7 41.91,10.16 41.91,8.89 41.91,7.62 3.81,20.07 44.45,19.05 3.81,3.81 11.43,3.81 21.59,3.81 24.13,3.81 26.67,3.81 44.45,3.81 38.61,11.56 29.21,19.05 26.67,19.05 24.13,19.05 6.35,19.05 31.75,19.05 21.59,19.05 29.21,3.81 31.75,3.81 39.37,3.81 46.99,19.05 36.83,19.05 13.36,16.51 49.53,1.27 52.07,1.27 32.36,16.61 34.8,15.85 37.39,17.07 50.39,5.69 51.16,9.35 21.69,15.8 28.4,13.36 7.39,7.92 7.57,14.17 11.38,9.91 14.88,9.75 7.32,12.65 19.46,9.75 18.24,7.92 17.53,15.85 16.51,3.81 29.21,11.43
  pour Top (rank 3): 0,22.86 53.34,22.86 53.34,0 0,0
  pour Bottom: 0,22.86 53.34,22.86 53.34,0 0,0
ID
  Top 0.152: J5.4 7.05,10.78 7.77,10.06 8.17,10.06 R11.1
ISET
  Top 0.152: U4.3 11.56,17.21 R13.1
NRST  (via drill 0.3, 0.3 pad 0.61)
  Top 0.152: 32.41,10.67 U3.7 31.71,10.68 v31.09,10.06 | S2.2 | 40.17,14.33 40.27,14.22 | 40.27,14.22 v39.8,14.22 39.78,14.25 | 40.27,14.22 S2.2 | S2.2 40.84,14.69 40.84,16.76 40.46,17.14 C15.2
  Bottom 0.152: J1.17 11.28,19.05 12.34,17.98 14.33,17.98 14.63,17.68 15.54,17.68 16.15,17.07 19.05,17.07 21.64,14.48 25.6,14.48 26.98,13.11 26.98,9.6 27.89,8.69 30.18,8.69 31.09,9.6 | v39.8,14.22 40.23,13.79 40.23,8.23 39.93,7.92 36.58,7.92 36.27,8.23 36.27,8.53 35.81,8.99 35.36,8.99 35.05,8.69 35.05,8.08 34.59,7.62 33.68,7.62 32.92,8.38 32,8.38 31.85,8.53 31.85,8.99 31.24,9.6 31.09,9.6 | 31.09,9.6 v31.09,10.06
OSCIN
  Top 0.152: U3.5 34.76,9.68 Y2.2 36.95,9.97 C4.1
OSCOUT
  Top 0.152: U3.6 33.19,10.18 33.4,10.39 33.4,10.92 34.35,11.87 Y2.1 35.07,11.89 35.74,11.89 36.45,11.18 37.02,11.18 C5.1
PA0  (via drill 0.3)
  Top 0.152: U3.14 31.25,14.18 v31.09,14.02
  Bottom 0.152: J1.5 39.57,17.98 37.49,17.98 37.19,17.68 35.1,17.68 33.38,15.95 33.38,15.25 32.91,14.78 31.85,14.78 v31.09,14.02
PA1  (via drill 0.3)
  Top 0.152: U3.15 31.34,14.68 v31.09,14.94
  Bottom 0.152: J1.6 37.03,17.98 34.95,17.98 33.07,16.1 33.07,15.39 32.77,15.09 31.24,15.09 v31.09,14.94
PA2  (via drill 0.3)
  Top 0.152: U3.16 32.42,15.66 v32.46,15.7
  Bottom 0.152: v32.46,15.7 32.64,15.88 32.64,16.13 J1.7
PA3
  Top 0.152: J1.8 31.15,17.18 U3.17
PA4
  Top 0.152: U3.20 28.92,17.8 30.18,19.05 J1.9
PA5
  Top 0.152: U3.21 28.42,18.57 J1.10
PA6  (via drill 0.3)
  Top 0.152: U3.22 27.92,16.43 v28.35,16
  Bottom 0.152: v28.35,16 27.46,16 25.4,18.06 J1.11
PA7  (via drill 0.3)
  Top 0.152: v27.99,15.32 27.74,15.57 27.74,15.85 27.58,16 27.58,16.31 27.42,16.47 U3.23
  Bottom 0.152: v27.99,15.32 27.69,15.32 26.24,16.76 25.45,16.76 24.84,17.37 23.62,17.37 22.86,18.14 J1.12
PA8  (via drill 0.3)
  Top 0.152: U3.41 21.59,11.18 22.25,10.52 v22.4,10.52
  Bottom 0.152: J2.16 13.72,3.81 14.78,4.88 16.92,4.88 17.22,5.18 19.2,5.18 20.57,6.55 20.57,8.23 22.1,9.75 22.1,10.21 v22.4,10.52
PA9  (via drill 0.3, 0.3 pad 0.61)
  Top 0.152: v15.54,16.31 15.54,17.13 R12.1 | v19.66,13.26 19.96,12.95 19.96,10.97 20.26,10.68 U3.42 20.93,10.67 21.64,10.67 21.79,10.52 21.79,10.36 22.4,9.75 v22.71,9.75
  Bottom 0.152: J2.15 16,4.57 17.07,4.57 17.37,4.88 19.36,4.88 20.88,6.4 20.88,8.08 22.55,9.75 v22.71,9.75 | v15.54,16.31 16,16.76 18.9,16.76 21.03,14.63 21.03,14.17 20.12,13.26 v19.66,13.26
PA10  (via drill 0.3, 0.3 pad 0.61)
  Top 0.152: U3.43 21.52,10.18 22.71,8.99 v23.16,8.99 | R11.2 8.26,8.51 8.84,7.92 8.84,5.18 9.14,4.88 9.14,4.42 8.84,4.12 v8.84,3.5
  Bottom 0.152: v8.84,3.5 9.6,2.74 16.76,2.74 17.78,3.76 J2.14 17.83,3.81 18.59,4.57 19.51,4.57 21.18,6.25 21.18,7.92 22.25,8.99 v23.16,8.99
PA11  (via drill 0.3)
  Top 0.152: R9.2 9.92,12.19 12.65,12.19 13.77,11.07 13.77,10.06 14.99,8.84 19.41,8.84 20.17,9.6 20.84,9.6 U3.44 20.95,9.65 21.59,9.65 22.71,8.53 22.71,8.38 22.86,8.38 v23.01,8.23
  Bottom 0.152: J2.13 20.32,4.93 21.49,6.1 21.49,7.77 22.1,8.38 22.86,8.38 v23.01,8.23
PA12  (via drill 0.3)
  Top 0.152: R8.2 9.53,11.19 R10.2 9.59,11.27 10.21,11.89 12.5,11.89 13.46,10.92 13.46,9.91 14.83,8.53 19.56,8.53 20.32,9.3 20.8,9.3 U3.45 21.61,9.18 22.33,8.46 v22.33,7.77
  Bottom 0.152: v22.33,7.77 22.1,7.77 21.79,7.47 21.79,4.88 J2.12
PA13  (via drill 0.3)
  Top 0.152: U3.46 20.96,8.64 21.69,8.64 21.79,8.53 21.79,7.32 22.1,7.01 v22.4,7.01 | J3.3 46.71,10.52 44.65,10.52 43.93,11.24 R14.1
  Bottom 0.152: J3.3 48.16,9.07 48.16,7.16 46.48,5.49 41.76,5.49 41.45,5.79 39.47,5.79 39.17,6.1 38.41,6.1 37.8,6.71 34.75,6.71 34.44,7.01 33.38,7.01 32.61,7.77 31.55,7.77 30.94,8.38 26.67,8.38 24.54,6.25 23.47,6.25 22.71,7.01 v22.4,7.01
PA14  (via drill 0.3)
  Top 0.152: 47.04,12.7 J3.2 48.06,12.7 48.77,13.41 48.77,16.46 48.08,17.14 R15.1 | v22.4,6.25 22.71,6.25 22.86,6.1 22.86,5.74 U3.49
  Bottom 0.152: v22.4,6.25 22.71,5.94 24.69,5.94 26.82,8.08 30.79,8.08 31.39,7.47 32.46,7.47 33.22,6.71 34.29,6.71 34.59,6.4 37.64,6.4 38.25,5.79 39.01,5.79 39.32,5.49 41.3,5.49 41.6,5.18 46.63,5.18 48.46,7.01 48.46,9.3 48.16,9.6 48.16,10.52 47.07,11.61 J3.2
PA15
  Top 0.152: J2.11 24.49,4.72 23.77,4.72 23.47,5.03 23.47,5.63 U3.50
PB0  (via drill 0.3)
  Top 0.152: U3.26 25.92,16.27 v26.21,15.98
  Bottom 0.152: v26.21,15.98 25.73,16.46 25.3,16.46 24.69,17.07 23.47,17.07 23.16,17.37 21.03,17.37 20.32,18.09 J1.13
PB1  (via drill 0.3)
  Top 0.152: U3.27 25.4,17.16 25.4,16.56 25.3,16.46 25.3,16 v25.45,15.85
  Bottom 0.152: J1.14 18.54,18.29 19.66,18.29 20.88,17.07 23.01,17.07 23.32,16.76 24.54,16.76 v25.45,15.85
PB2
  Top 0.152: U3.28 24.92,15.93 24.23,15.24 23.32,15.24 22.1,16.46 20.57,16.46 20.12,16 20.12,15.47 19.25,14.61 R1.1
PB3
  Top 0.152: U3.55 25.92,5.02 26.21,4.72 27.03,4.72 J2.10
PB4  (via drill 0.3)
  Top 0.152: U3.56 26.42,6.8 v26.36,6.86
  Bottom 0.152: v26.36,6.86 27.28,5.94 28.5,5.94 28.8,5.64 29.26,5.64 29.57,5.33 30.33,5.33 30.94,4.72 30.94,4.27 J2.9
PB5  (via drill 0.3)
  Top 0.152: U3.57 26.92,6.66 26.98,6.71 v26.98,7.47
  Bottom 0.152: v26.98,7.47 26.98,6.71 27.43,6.25 28.65,6.25 28.96,5.94 29.41,5.94 29.72,5.64 30.48,5.64 31.55,4.57 32.26,4.57 J2.8
PB6  (via drill 0.3)
  Top 0.152: U3.58 27.42,6.69 v27.58,6.86
  Bottom 0.152: J2.7 34.8,4.57 33.68,4.57 33.38,4.88 31.7,4.88 30.63,5.94 29.87,5.94 29.57,6.25 29.11,6.25 28.8,6.55 27.89,6.55 v27.58,6.86
PB7  (via drill 0.3)
  Top 0.152: U3.59 27.94,5.7 27.94,6.45 28.35,6.86 28.35,7.01 28.04,7.32 v28.04,7.47
  Bottom 0.152: J2.6 37.95,3.81 37.49,4.27 36.88,4.27 36.27,4.88 33.83,4.88 33.53,5.18 31.85,5.18 30.79,6.25 30.02,6.25 29.72,6.55 29.26,6.55 28.96,6.86 28.65,6.86 v28.04,7.47
PB8  (via drill 0.3)
  Top 0.152: U3.61 28.92,6.52 29.41,7.01 29.41,7.16 v29.72,7.47 | R5.1 40.32,4.13 J2.5
  Bottom 0.152: J2.5 39.88,4.57 38.86,4.57 38.56,4.88 37.8,4.88 37.19,5.49 34.14,5.49 33.83,5.79 32.16,5.79 31.09,6.86 30.33,6.86 v29.72,7.47
PB9  (via drill 0.3)
  Top 0.152: U3.62 29.42,6.25 29.41,6.25 29.41,6.55 29.57,6.71 29.72,6.71 30.48,7.47 v30.63,7.47
  Bottom 0.152: J2.4 42.42,4.57 41.3,4.57 41,4.88 39.01,4.88 38.71,5.18 37.95,5.18 37.34,5.79 34.29,5.79 33.98,6.1 32.31,6.1 30.94,7.47 v30.63,7.47
PB10  (via drill 0.3)
  Top 0.152: U3.29 24.42,16.22 v24.36,16.15
  Bottom 0.152: J1.15 15.85,18.44 16.92,18.44 17.37,17.98 19.51,17.98 20.73,16.76 22.86,16.76 23.16,16.46 24.05,16.46 v24.36,16.15
PB11  (via drill 0.3)
  Top 0.152: U3.30 23.88,17.14 23.88,16.41 23.47,16 v23.47,15.85
  Bottom 0.152: J1.16 13.46,18.29 14.48,18.29 14.78,17.98 15.7,17.98 15.85,18.14 16.76,18.14 17.22,17.68 19.36,17.68 20.57,16.46 22.71,16.46 23.32,15.85 v23.47,15.85
PB12  (via drill 0.3 pad 0.61)
  Top 0.152: U3.33 20.29,15.18 18.97,13.87 16.31,13.87 16,14.17 v16,14.48 | v7.16,5.49 4.22,5.49 J2.20
  Bottom 0.152: v7.16,5.49 7.47,5.49 8.08,6.1 8.08,12.04 8.99,12.95 10.97,12.95 11.73,13.72 12.34,13.72 12.8,14.17 12.8,15.39 13.11,15.7 14.78,15.7 v16,14.48
PB13  (via drill 0.3 pad 0.61)
  Top 0.152: 20.97,14.73 U3.34 20.24,14.68 19.13,13.56 15.39,13.56 v15.24,13.72 | v8.53,4.72 8.38,4.88 6.15,4.88 J2.19
  Bottom 0.152: v8.53,4.72 8.38,4.88 8.38,11.89 9.14,12.65 11.12,12.65 11.89,13.41 12.5,13.41 13.11,14.02 13.11,14.25 13.26,14.4 14.86,14.4 15.24,14.02 v15.24,13.72
PB14  (via drill 0.3)
  Top 0.152: U3.35 21.94,14.18 23.77,12.34 23.77,11.73 24.23,11.28 v24.54,11.28
  Bottom 0.152: J2.18 7.92,4.12 8.99,4.12 9.75,4.88 11.73,4.88 12.04,5.18 14.17,5.18 14.48,5.49 16.61,5.49 16.92,5.79 18.9,5.79 19.96,6.86 19.96,8.53 21.49,10.06 21.49,10.82 22.1,11.43 22.71,11.43 22.86,11.28 v24.54,11.28
PB15  (via drill 0.3)
  Top 0.152: U3.36 21.98,13.68 23.47,12.19 23.47,11.58 23.93,11.12 23.93,10.82 24.23,10.52 v24.54,10.52
  Bottom 0.152: J2.17 10.92,4.57 11.89,4.57 12.19,4.88 14.33,4.88 14.63,5.18 16.76,5.18 17.07,5.49 19.05,5.49 20.27,6.71 20.27,8.38 21.79,9.91 21.79,10.67 22.25,11.12 22.55,11.12 23.16,10.52 v24.54,10.52
PC1  (via drill 0.3)
  Top 0.152: v31.09,11.28 31.49,11.68 U3.9
  Bottom 0.152: v31.09,11.28 31.09,10.82 | 31.09,10.82 30.02,9.75 30.02,9.53 PC1.1 | R21.2 R22.1 39.57,11.94 39.93,11.58 39.93,8.38 39.78,8.23 36.73,8.23 36.58,8.38 36.58,8.69 35.97,9.3 35.2,9.3 34.75,8.84 34.75,8.23 34.44,7.92 33.83,7.92 33.07,8.69 32.31,8.69 32.16,8.84 32.16,9.14 31.7,9.6 31.7,10.21 31.09,10.82
PC2  (via drill 0.3)
  Top 0.152: U3.10 31.25,12.18 v31.09,12.34
  Bottom 0.152: v31.09,12.34 31.09,12.04 29.97,10.92 PC2.1
PC3  (via drill 0.3)
  Top 0.152: U3.11 31.82,12.68 31.24,13.26 v31.09,13.26
  Bottom 0.152: v31.09,13.26 31.09,13.18 PC3.1
PC4  (via drill 0.3 pad 0.61)
  Top 0.152: U3.24 26.92,16.51 27.13,16.31 27.13,16 27.43,15.7 27.43,15.09 28.04,14.48 v28.04,14.17
  Bottom 0.152: v28.04,14.17 29.13,14.17 PC4.1
PC5  (via drill 0.3)
  Top 0.152: U3.25 26.42,16.56 26.82,16.15 v26.82,15.39
  Bottom 0.152: v26.82,15.39 27.13,15.39 27.74,14.78 29.79,14.78 PC5.1
PC6  (via drill 0.3 pad 0.61)
  Top 0.152: U3.37 22.02,13.18 23.16,12.04 23.16,11.43 23.62,10.97 23.62,10.52 24.23,9.91 24.69,9.91 25.15,10.36 25.15,11.58 25.45,11.89 28.19,11.89 29.26,12.95 29.26,14.94 29.87,15.54 31.09,15.54 31.39,15.85 v31.7,15.85
  Bottom 0.152: v31.7,15.85 30,15.85 PC6.1
PC7  (via drill 0.3, 0.3 pad 0.61)
  Top 0.152: v22.4,12.04 21.76,12.68 U3.38 | v28.96,15.54 28.96,13.11 28.04,12.19 24.69,12.19 v24.54,12.04
  Bottom 0.152: v28.96,15.54 29.11,15.7 29.11,16.28 PC7.1 | v24.54,12.04 v22.4,12.04
PC13  (via drill 0.3)
  Top 0.152: J1.2 49.07,18.24 49.07,12.04 48.27,11.24 R3.1 | v31.24,8.84 31.24,8.53 31.32,8.46 31.55,8.23 31.6,8.18 U3.2
  Bottom 0.152: J1.2 47.19,17.98 45.11,17.98 44.81,17.68 42.7,17.68 41.15,16.13 41.15,7.77 40.39,7.01 34.9,7.01 34.59,7.32 33.53,7.32 32.77,8.08 31.7,8.08 31.24,8.53 v31.24,8.84
PC14  (via drill 0.3)
  Top 0.152: U3.3 33.08,8.68 33.4,8.36 33.4,7.49 34.02,6.87 Y1.2 34.61,6.87 v35.31,7.57 35.89,6.99 C2.1
  Bottom 0.152: J1.3 44.65,17.98 42.55,17.98 40.84,16.28 40.84,7.92 40.23,7.32 35.56,7.32 v35.31,7.57
PC15  (via drill 0.3)
  Top 0.152: U3.4 33.19,9.18 33.83,8.53 34.25,8.53 Y1.1 35.55,8.37 v35.59,8.41 35.74,8.26 C3.1
  Bottom 0.152: J1.4 40.54,16.41 40.54,8.08 40.08,7.62 36.37,7.62 v35.59,8.41
PROG
  Bottom 0.152: U5.5 49.09,7.75 R17.1
R6
  Top 0.152: R6.2 42.99,16.31 S2.3
SDIO_CK  (via drill 0.3)
  Top 0.152: v23.77,8.23 23.77,7.92 24.92,6.78 U3.53
  Bottom 0.152: J4.P5 14.07,10.67 14.48,10.67 14.78,10.97 19.66,10.97 21.95,13.26 24.99,13.26 25.76,12.5 25.76,9.3 24.99,8.53 24.38,8.53 24.08,8.23 v23.77,8.23
SDIO_CMD  (via drill 0.3)
  Top 0.152: U3.54 25.42,6.74 24.54,7.62 v24.54,7.92
  Bottom 0.152: J4.P3 14.67,12.76 16.15,11.28 19.51,11.28 21.79,13.56 25.15,13.56 26.06,12.65 26.06,9.14 24.84,7.92 v24.54,7.92
SDIO_D0  (via drill 0.3 pad 0.61)
  Top 0.152: U3.39 21.5,12.18 22.25,11.43 22.71,11.43 23.32,10.82 23.32,10.36 24.08,9.6 24.23,9.6 v24.69,9.14
  Bottom 0.152: J4.P7 13.99,8.38 14.78,8.38 15.54,9.14 15.54,10.06 16.15,10.67 19.81,10.67 22.1,12.95 24.84,12.95 25.45,12.34 25.45,9.45 25.15,9.14 v24.69,9.14
SDIO_D1  (via drill 0.3 pad 0.61)
  Top 0.152: U3.40 21.54,11.68 22.1,11.12 22.55,11.12 23.01,10.67 23.01,10.21 23.93,9.3 v23.93,8.99
  Bottom 0.152: J4.P8 14.02,7.32 14.63,7.32 14.94,7.62 14.94,8.08 15.85,8.99 15.85,9.91 16.31,10.36 19.96,10.36 22.25,12.65 24.69,12.65 25.15,12.19 25.15,10.36 23.93,9.14 v23.93,8.99
SDIO_D2  (via drill 0.3)
  Top 0.152: U3.51 23.92,6.56 v23.62,6.86
  Bottom 0.152: J4.P1 14.76,14.96 15.85,13.87 15.85,12.5 16.46,11.89 19.2,11.89 21.49,14.17 25.45,14.17 26.67,12.95 26.67,8.84 24.69,6.86 v23.62,6.86
SDIO_D3  (via drill 0.3, 0.3 pad 0.61)
  Top 0.152: R16.1 16.89,7.34 16.74,7.34 16.31,7.77 14.63,7.77 14.33,8.08 13.56,8.08 12.8,8.84 12.8,9.45 12.5,9.75 v12.19,9.75 | v23.06,7.47 23.77,7.47 24.42,6.82 U3.52
  Bottom 0.152: v23.06,7.47 23.77,7.47 23.93,7.32 24.69,7.32 26.36,8.99 26.36,12.8 25.3,13.87 21.64,13.87 19.36,11.58 16.31,11.58 15.54,12.34 15.54,12.65 14.33,13.86 J4.P2 13.82,13.72 13.26,13.72 12.95,13.41 12.95,12.19 12.34,11.58 12.34,9.91 v12.19,9.75
SDIO_VDD  (via drill 0.3 pad 0.61)
  Top 0.457: v12.93,7.77 13.11,7.77 13.26,7.62 14.02,7.62 14.11,7.53 L3.1 14.43,6.6 14.94,6.1 15.18,6.1 C16.2
  Bottom 0.457: J4.P4 13.19,11.66 12.93,11.4 v12.93,7.77
VBK  (via drill 0.3 pad 0.61)
  Top 0.152: 32.46,7.64 U3.1 32.36,7.62 32.31,7.62 v32.31,6.86 | J1.1 50.8,19 51.82,17.98 51.82,5.64 51.05,4.88 48.92,4.88 v48.77,5.03
  Bottom 0.152: v32.31,6.86 32.77,6.4 34.14,6.4 34.44,6.1 37.49,6.1 38.1,5.49 38.86,5.49 39.17,5.18 41.15,5.18 41.45,4.88 48.62,4.88 v48.77,5.03
VBUS
  Top 0.152: 14.1,17.14 R12.2 14.16,16.14 13.87,15.85 13.26,15.85 12.78,15.37 D3.A
  Top 0.457: D3.A 11.95,15.31 U4.1 9.69,15.31 8.99,16 7.16,16 5.64,14.48 5.64,12.73 J5.1
VBUS_EN  (via drill 0.3)
  Top 0.152: U4.4 7.94,17.26 8.67,17.98 16.08,17.98 v16.46,17.6 16.76,17.3 R7.1 | U3.8 31.75,11.18 31.24,10.67 28.35,10.67 v28.04,10.97
  Bottom 0.152: v28.04,10.97 27.28,11.73 27.28,13.26 25.76,14.78 21.79,14.78 19.2,17.37 16.92,17.37 16.69,17.6 v16.46,17.6
VCAP_1
  Top 0.152: U3.31 23.42,16.56 23.16,16.31 22.71,16.31 22.25,16.76 20.32,16.76 19.43,15.88 C11.2
VCAP_2
  Top 0.152: U3.47 20.22,8.18 19.49,7.46 C14.2

### Text on the board
Top: Component Side (.CMP)
Bottom: Solder side (.SOL)
tPlace: GND | GND | 3V3 | RST | B11 | B10 | B1 | B0 | A7 | A6 | A5 | A4 | A3 | A2 | A1 | A0 | C15 | C14 | C13 | VBK | USER | GND | RESET | SCK | BOOT0 / /USER | DIO | 3V3 | PWR | B12 | B13 | B14 | B15 | A8 | A9 | A10 | A11 | A12 | A15 | B3 | B4 | B5 | B6 | B7 | B8 | B9 | 5V | GND | 3V3A | Silk screen CMP (.PLC)
bPlace: GND | GND | 3V3 | RST | B11 | B10 | B1 | B0 | A7 | A6 | A5 | A4 | A3 | A2 | A1 | A0 | C15 | C14 | C13 | VBK | PC7 | PC6 | PC5 | PC4 | BluePill F4 / (c) 2017-2018 | PC3 | PC2 | Rev. | PC1 | CC-BY-SA | www.stm32duino.com | B12 | B13 | B14 | B15 | A8 | A9 | A10 | A11 | A12 | A15 | B3 | B4 | B5 | B6 | B7 | B8 | B9 | 5V | GND | 3V3A | Silk screen SOL (.PLS)
tStop: Solder stop mask CMP (.STC)
bStop: Solder stop mask SOL (.STS)
tCream: Cream frame CMP (.CRC)
bCream: Cream frame SOL (.CRS)
Measures: Outline (.OLN)
Document: STACK-UP FOR REFERENCE | LAYER 1 L1 TOP | 35 UM (1 OZ) CU + 12.5 UM / PLATING(47.5 UM) | 1.2 MM (47 MIL) | CORE | 43 MIL (1.09 MM) IS 410 COMPATIBLE / CORE FR-4 TG130 (S1151 130) | LAYER 4 L16 BOTTOM | 35 UM CU + 12.5 UM PLATING (30.5 UM) | NOTES: | 1. PRINTED CIRCUIT BOARD MADE FROM NEMA GRADE FR-4 TG 130 EPOXY / LAMINATE WITH 35 UM COPPER PLATING AND 1.2 MM THICKNESS. | 2. ALL DIMENSIONS ARE GIVEN IN MILLIMETERS EXCEPT TRACE WIDTH/SPACE. | 3. CIRCUIT PATHS ARE FOR REFERENCE ONLY. | 4. HOLE SIZES SHOWN ARE FINISHED DIAMETERS AFTER PLATING. | 5. BOARD PLATED USING REFLOW OR SIMILAR METHOD. | 6. BOARD TO HAVE BLUE SOLDER MASK ON PLATED SURFACES USING WET / FILM SR100 OR SR1010 EPOXY. / EQUIVALENT WET OR DRY FILM MAY BE USED. | 7. SILKSCREEN BOARD USING WHITE INK. DISTORTION OF SILKSCREEN / IS ACCEPTABLE OVER TRACES. EPOXY INK ON PLATED LANDS IS NOT / ACCEPTABLE | 8. THE FOLLOWING INFORMATION APPLIES TO THIS BOARD: | * 2 COPPER LAYERS | * 1.2 MM BOARD THICKNESS | * REQUIRES TOP AND BOTTOM SIDE SILKSCREENS | © 2017-2018, | All rights reserved. | Licensed under a Creative Commons / Attribution-Share-Alike Unported License. / See creativecommons.org/licenses/by-sa/4.0/ | Reference designs are provided "AS IS" and "WITH ALL FAULTS". / The author(s) disclaims all other warranties express or implied, / regarding this product, including but not limited to, any implied warranties of / merchantibility or fitness for any particular application. | The author(s) may make changes to specifications and product descriptions / at any time, without notice. | Rev.
tDocu: Component Assembly CMP (.ASC)
bDocu: Component Assembly SOL (.ASS)
DrillLegend: LAYER-STACK
DrillLegend_01-16: 01-16 | Drill data (.DRD)
Pinout: GND | GND | +3.3V | NRST | PB11 | PB10 | PB1 | PB0 | PA7 | PA6 | PA5 | PA4 | PA3 | PA2 | PA1 | PA0 | PC15 | PC14 | PC13 | VBACKUP | GND | SWDCLK | SWDIO | +3.3V | BP12 | PB13 | PB14 | PB15 | PA8 | PA9 | PA10 | PA11 | PA12 | PA15 | PB3 | PB4 | PB5 | PB6 | PB7 | PB8 | PB9 | +5V | GND | +3.3V(A) | Pinout (.PIN)